# Altium schematic sheet Connectors.SchDoc
size A4; SheetNumber: 2; SheetTotal: 7
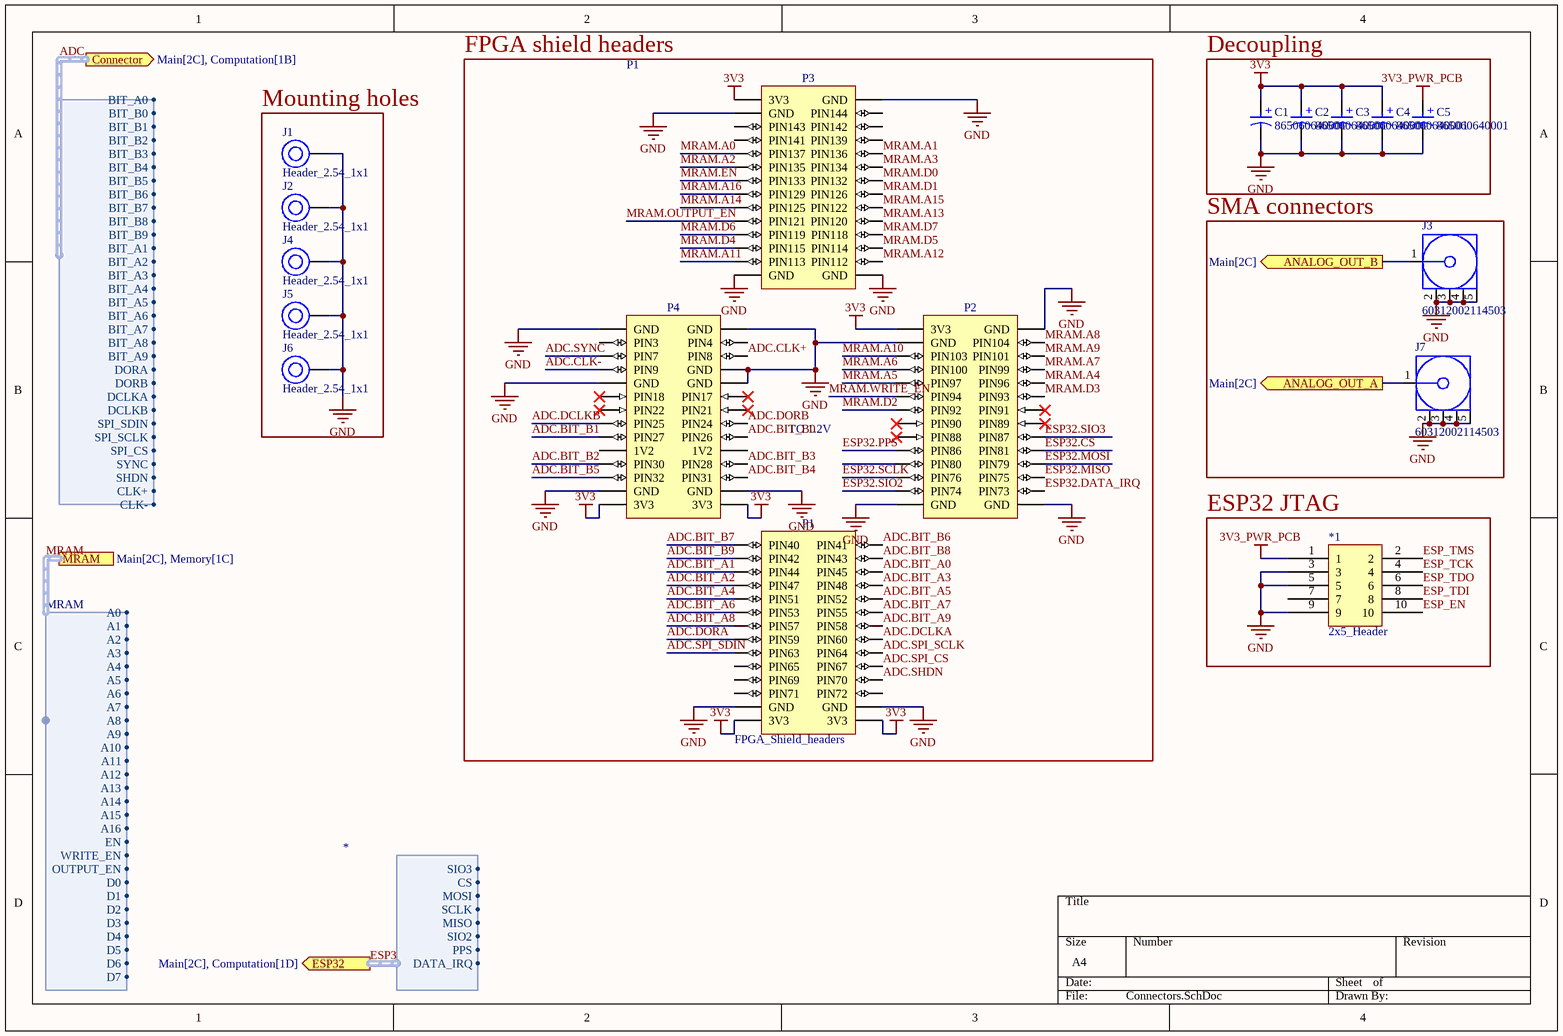
[diagram p0: Connectors.SchDoc]

## Parts
*1  2x5_Header  [2x5_HEADER]
C1  865060640001  [WCAP-ASLL_D4H5.5]
C2  865060640001  [WCAP-ASLL_D4H5.5]
C3  865060640001  [WCAP-ASLL_D4H5.5]
C4  865060640001  [WCAP-ASLL_D4H5.5]
C5  865060640001  [WCAP-ASLL_D4H5.5]
J1  Header_2.54_1x1  [HEADER_2.54_1x1]
J2  Header_2.54_1x1  [HEADER_2.54_1x1]
J3  60312002114503  [60312002114503]
J4  Header_2.54_1x1  [HEADER_2.54_1x1]
J5  Header_2.54_1x1  [HEADER_2.54_1x1]
J6  Header_2.54_1x1  [HEADER_2.54_1x1]
J7  60312002114503  [60312002114503]
P1  FPGA_Shield_headers  [FPGA_SHIELD_HEADER_FOOTPRINT]

## Blocks framed on the sheet
FPGA shield headers: P1
Decoupling: C1-C5
Mounting holes: J1 J2 J4-J6
SMA connectors: J3 J7
ESP32 JTAG: *1

## Ports
ANALOG_OUT_A (out, see Main[2C]), ANALOG_OUT_B (out, see Main[2C]), Connector (out, harness Connector, see Main[2C], Computation[1B]), ESP32 (out, harness *, see Main[2C], Computation[1D]), MRAM (harness MRAM, see Main[2C], Memory[1C])

## Harnesses
Connector: BIT_B1, BIT_B2, BIT_B3, BIT_B4, BIT_B5, BIT_B6, BIT_B7, BIT_B8, BIT_B9, BIT_A1, BIT_A2, BIT_A3, BIT_A4, BIT_A5, BIT_A6, BIT_A7, BIT_A8, BIT_A9, DORA, DORB, DCLKA, DCLKB, SPI_SDIN, SPI_SCLK, SPI_CS, SYNC, SHDN, BIT_B0, BIT_A0, CLK+, CLK-
MRAM: A0, A1, A2, A3, A4, A5, A6, A7, A8, A9, A10, A11, A12, A13, A14, A15, A16, EN, WRITE_EN, OUTPUT_EN, D0, D1, D2, D3, D4, D5, D6, D7
*: SIO3, CS, MOSI, SCLK, MISO, SIO2, PPS, DATA_IRQ

## Nets
3V3: C1.1(P) C2.1(P) C3.1(P) C4.1(P) P1.27(3V3) P1.28(3V3) P1.29(3V3) P1.57(3V3) P1.111(3V3) P1.112(3V3)
3V3_PWR_PCB: *1.1 C5.1(P)
GND: *1.3 *1.5 *1.9 C1.2(N) C2.2(N) C3.2(N) C4.2(N) C5.2(N) J1.0 J2.0 J3.2(GND) J3.3(GND) J3.4(GND) J3.5(GND) J4.0 J5.0 J6.0 J7.2(GND) J7.3(GND) J7.4(GND) J7.5(GND) P1.1(GND) P1.2(GND) P1.8(GND) P1.9(GND) P1.10(GND) P1.25(GND) P1.26(GND) P1.30(GND) P1.31(GND) P1.55(GND) P1.56(GND) P1.58(GND) P1.59(GND) P1.83(GND) P1.84(GND) P1.109(GND) P1.110(GND)
ADC.BIT_A0: P1.90(PIN45)
ADC.BIT_A1: P1.89(PIN44)
ADC.BIT_A2: P1.91(PIN47)
ADC.BIT_A3: P1.92(PIN48)
ADC.BIT_A4: P1.93(PIN51)
ADC.BIT_A5: P1.94(PIN52)
ADC.BIT_A6: P1.95(PIN53)
ADC.BIT_A7: P1.96(PIN55)
ADC.BIT_A8: P1.97(PIN57)
ADC.BIT_A9: P1.98(PIN58)
ADC.BIT_B0: P1.18(PIN26)
ADC.BIT_B1: P1.17(PIN27)
ADC.BIT_B2: P1.21(PIN30)
ADC.BIT_B3: P1.22(PIN28)
ADC.BIT_B4: P1.24(PIN31)
ADC.BIT_B5: P1.23(PIN32)
ADC.BIT_B6: P1.86(PIN41)
ADC.BIT_B7: P1.85(PIN40)
ADC.BIT_B8: P1.88(PIN43)
ADC.BIT_B9: P1.87(PIN42)
ADC.CLK+: P1.6(PIN8)
ADC.CLK-: P1.7(PIN9)
ADC.DCLKA: P1.100(PIN60)
ADC.DCLKB: P1.15(PIN25)
ADC.DORA: P1.99(PIN59)
ADC.DORB: P1.16(PIN24)
ADC.SHDN: P1.106(PIN70)
ADC.SPI_CS: P1.104(PIN67)
ADC.SPI_SCLK: P1.102(PIN64)
ADC.SPI_SDIN: P1.101(PIN63)
ADC.SYNC: P1.5(PIN7)
ANALOG_OUT_A: J7.1(Signal) ; port ANALOG_OUT_A
ANALOG_OUT_B: J3.1(Signal) ; port ANALOG_OUT_B
ESP32.CS: P1.76(PIN81)
ESP32.DATA_IRQ: P1.82(PIN73)
ESP32.MISO: P1.80(PIN75)
ESP32.MOSI: P1.78(PIN79)
ESP32.PPS: P1.75(PIN86)
ESP32.SCLK: P1.79(PIN76)
ESP32.SIO2: P1.81(PIN74)
ESP32.SIO3: P1.74(PIN87)
ESP_EN: *1.10
ESP_TCK: *1.4
ESP_TDI: *1.8
ESP_TDO: *1.6
ESP_TMS: *1.2
MRAM.A0: P1.37(PIN137)
MRAM.A1: P1.38(PIN136)
MRAM.A2: P1.39(PIN135)
MRAM.A3: P1.40(PIN134)
MRAM.A4: P1.66(PIN96)
MRAM.A5: P1.65(PIN97)
MRAM.A6: P1.63(PIN100)
MRAM.A7: P1.64(PIN99)
MRAM.A8: P1.60(PIN104)
MRAM.A9: P1.62(PIN101)
MRAM.A10: P1.61(PIN103)
MRAM.A11: P1.53(PIN113)
MRAM.A12: P1.54(PIN112)
MRAM.A13: P1.48(PIN120)
MRAM.A14: P1.45(PIN125)
MRAM.A15: P1.46(PIN122)
MRAM.A16: P1.43(PIN129)
MRAM.D0: P1.42(PIN132)
MRAM.D1: P1.44(PIN126)
MRAM.D2: P1.69(PIN92)
MRAM.D3: P1.68(PIN93)
MRAM.D4: P1.51(PIN115)
MRAM.D5: P1.52(PIN114)
MRAM.D6: P1.49(PIN119)
MRAM.D7: P1.50(PIN118)
MRAM.EN: P1.41(PIN133)
MRAM.OUTPUT_EN: P1.47(PIN121)
MRAM.WRITE_EN: P1.67(PIN94)

Not connected (* = marked no-connect by the designer): *1 7; P1 3(PIN3) 4(PIN4) 11(PIN18)* 12(PIN17)* 13(PIN22)* 14(PIN21)* 19(1V2) 20(1V2) 32(PIN144) 33(PIN143) 34(PIN142) 35(PIN141) 36(PIN139) 70(PIN91)* 71(PIN90)* 72(PIN89)* 73(PIN88)* 77(PIN80) 103(PIN65) 105(PIN69) 107(PIN71) 108(PIN72)

## Buses and harness runs
harness ADC = port Connector
harness ESP32 = port ESP32
harness MRAM = port MRAM

## Notes on the sheet
- (near P1) TO 1.2V
- (in symbol CMP-03913-53914524-1) +
- (in symbol FPGA_Shield_headers) P3; P4; P2

## Library data of the parts
C1-C5 = CMP-03913-53914524-1: 865060640001 WCAP-ASLL Aluminum Electrolytic Capacitors; Life (Hours): 2000hours; Polarity: Polar; Voltage Rating: 50V; Leakage Current: 3µA; Capacitance: 1µF; Ripple Current: 60mA; Tolerance: 20%; Insulation Resistance: 16.6667MΩ; Impedance: 4.4Ω; Min Operating Temperature: -55°C; NexarPartId: 53914524; Height - Seated (Max): 5.5118mm; Height: 5.5mm; Max Operating Temperature: 105°C; Length: 5.5mm; RoHS: Compliant; Voltage Rating (DC): 50V; Mount: Surface Mount; Ripple Current (AC): 60mA; Case/Package: Radial; Packaging: Tape & Reel (TR); Diameter: 4mm; REACH SVHC: Unknown
  C1: ComponentLink1Description: Buy; ComponentLink1URL: https://www.we-online.com/en/components/products/WCAP-ASLL#/articles/WCAP_ASLL_SIZE_4
J1 J2 J4-J6 = Header_2.54_1x1: Header 1x1
J3 J7 = CMP-207975-000002-2: SMA PCB THT JACK STRAIGHT WR-SMA; NexarPartId: 97004423; Insertion Loss (dB): 0.14dB; Number of Contacts: 1; Voltage Rating: 335V; Impedance: 50Ω; Frequency: 18GHz; Dielectric Material: PTFE; Insulation Resistance: 5GΩ; Orientation: Straight; Contact Material: Gold, Nickel; Min Operating Temperature: -65°C; Insulation Material: PTFE; Connector Type: SMA; Max Operating Temperature: 165°C; Height: 9.76mm